# EAGLE design Large Simon Says (EAGLE 6.4)
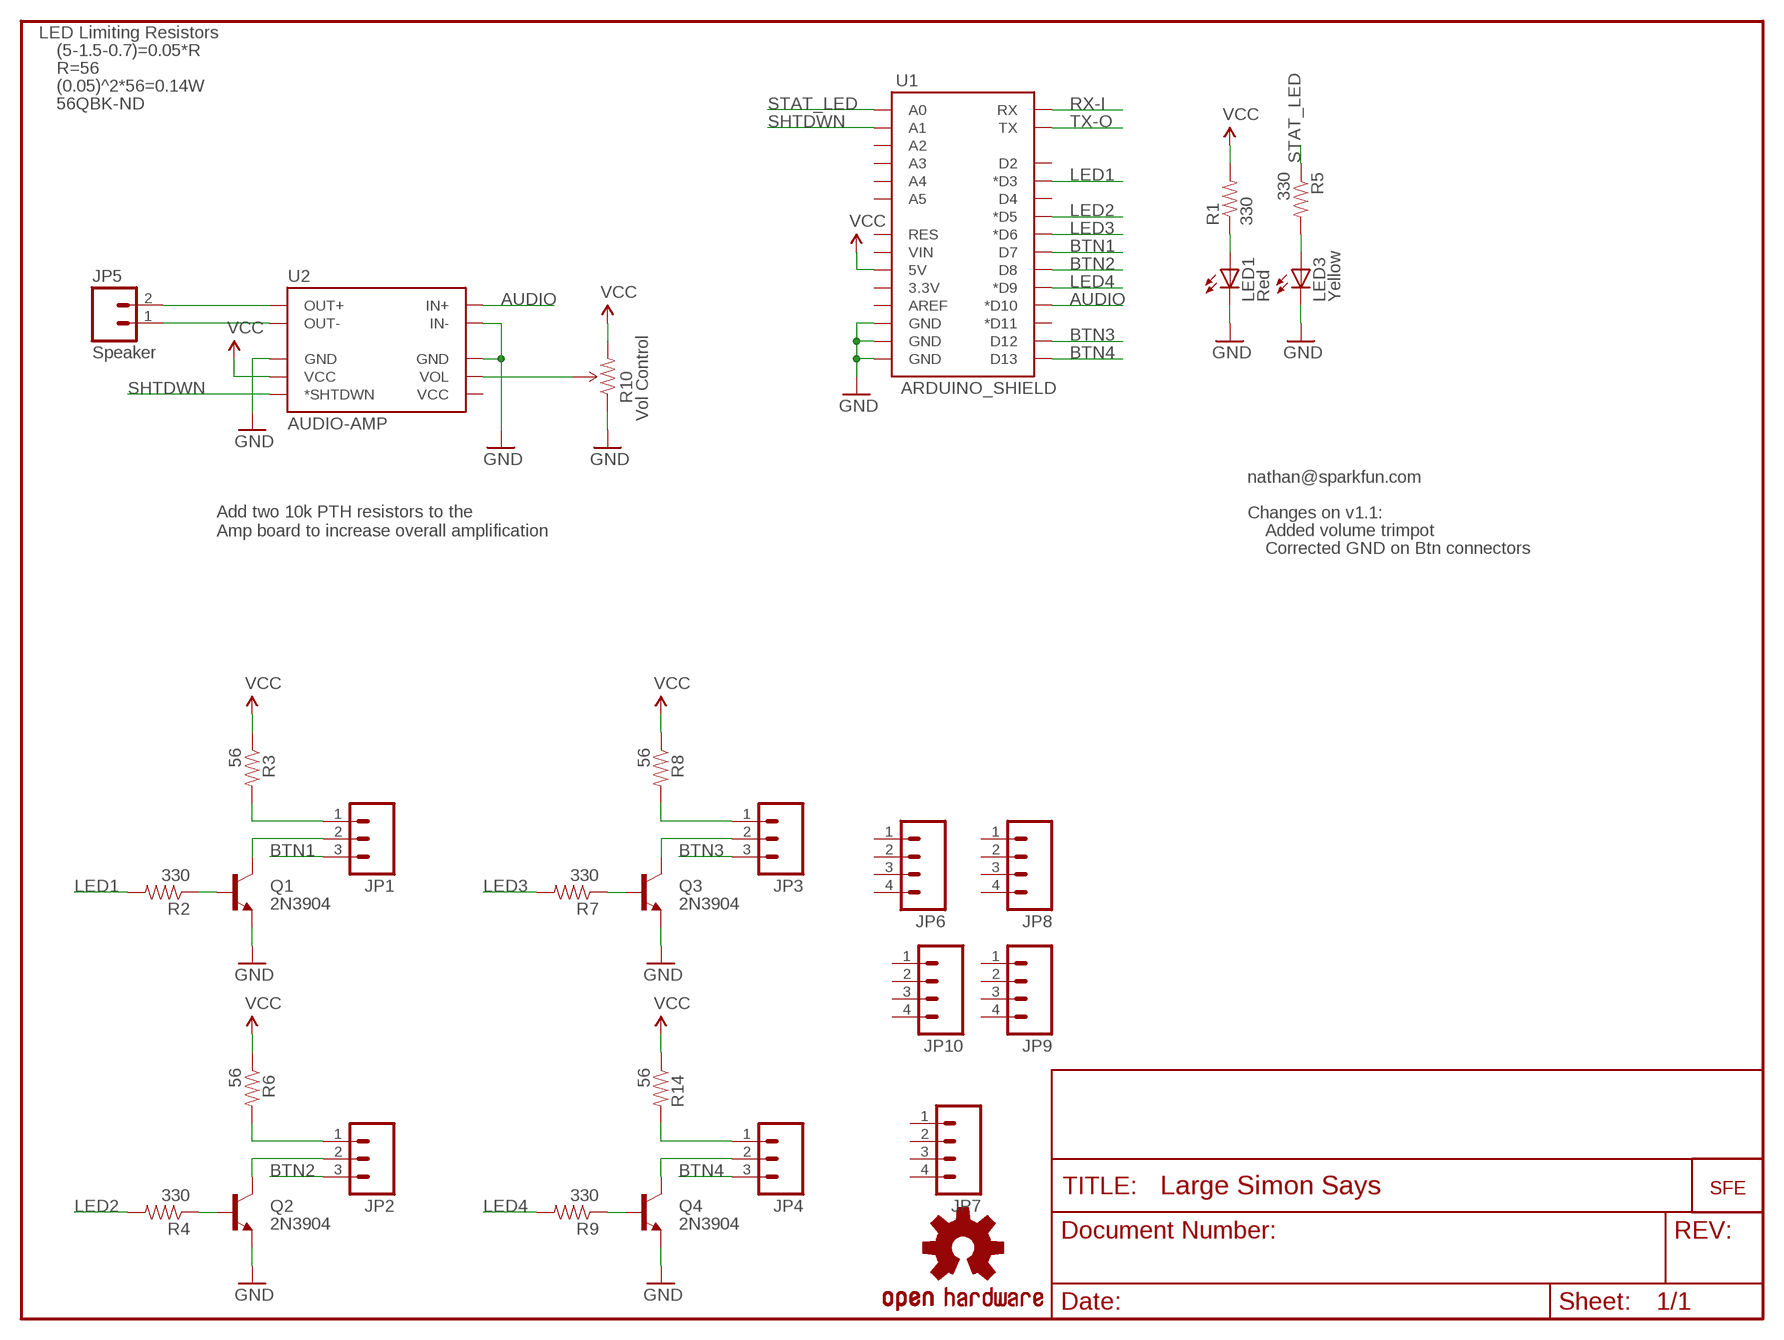
[diagram p0: schematic, sheet 1]

## Parts
JP1  M03JST-PTH-VERT  [JST-3-PTH-VERT]
JP2  M03JST-PTH-VERT  [JST-3-PTH-VERT]
JP3  M03JST-PTH-VERT  [JST-3-PTH-VERT]
JP4  M03JST-PTH-VERT  [JST-3-PTH-VERT]
JP5  Speaker  M02JST-PTH-2  [JST-2-PTH]
JP6  M04JST-PTH  [JST-4-PTH]
JP7  M04JST-PTH  [JST-4-PTH]
JP8  M04JST-PTH  [JST-4-PTH]
JP9  M04JST-PTH  [JST-4-PTH]
JP10  M04JST-PTH  [JST-4-PTH]
LED1  Red  LED5MM  [LED5MM]
LED3  Yellow  LED5MM  [LED5MM]
Q1  2N3904  TRANSISTOR_NPNTO92  [TO-92]
Q2  2N3904  TRANSISTOR_NPNTO92  [TO-92]
Q3  2N3904  TRANSISTOR_NPNTO92  [TO-92]
Q4  2N3904  TRANSISTOR_NPNTO92  [TO-92]
R1  330  RESISTORAXIAL-0.3  [AXIAL-0.3]
R2  330  RESISTORAXIAL-0.3  [AXIAL-0.3]
R3  56  RESISTORAXIAL-0.3  [AXIAL-0.3]
R4  330  RESISTORAXIAL-0.3  [AXIAL-0.3]
R5  330  RESISTORAXIAL-0.3  [AXIAL-0.3]
R6  56  RESISTORAXIAL-0.3  [AXIAL-0.3]
R7  330  RESISTORAXIAL-0.3  [AXIAL-0.3]
R8  56  RESISTORAXIAL-0.3  [AXIAL-0.3]
R9  330  RESISTORAXIAL-0.3  [AXIAL-0.3]
R10  Vol Control  TRIMPOT-PTH-KNOB  [3386U]
R14  56  RESISTORAXIAL-0.3  [AXIAL-0.3]
U1  ARDUINO_SHIELD  ARDUINO_SHIELDNOHOLES  [DUEMILANOVE_SHIELD_NOHOLES]
U2  AUDIO-AMP  AUDIO-AMP-MONODIP  [AUDIO-AMP-MONO]
U$1  LOGO-SFENEW  [SFE-NEW-WEBLOGO]
U$3  OSHW-LOGOS  [OSHW-LOGO-S]

## Nets
AUDIO: U1.D10(*D10) U2.IN+
BTN1: JP1.3 U1.D7
BTN2: JP2.3 U1.D8
BTN3: JP3.3 U1.D12
BTN4: JP4.3 U1.D13
GND: LED1.K(C) LED3.K(C) Q1.1(E) Q2.1(E) Q3.1(E) Q4.1(E) R10.1(CCW) U1.GND@0(GND) U1.GND@1(GND) U1.GND@2(GND) U2.IN- U2.PWR-(GND) U2.VOL-(GND)
LED1: R2.P$2 U1.D3(*D3)
LED2: R4.P$2 U1.D5(*D5)
LED3: R7.P$2 U1.D6(*D6)
LED4: R9.P$2 U1.D9(*D9)
N$1: LED1.A R1.P$1
N$2: Q1.2(B) R2.P$1
N$3: JP1.2 Q1.3(C)
N$4: LED3.A R5.P$2
N$5: JP1.1 R3.P$2
N$6: JP2.2 Q2.3(C)
N$7: JP4.2 Q4.3(C)
N$8: JP5.2 U2.OUT+
N$9: Q2.2(B) R4.P$1
N$10: JP2.1 R6.P$2
N$11: Q3.2(B) R7.P$1
N$12: Q4.2(B) R9.P$1
N$13: JP5.1 U2.OUT-
N$14: R10.2(WIPER) U2.VOL
N$17: JP3.1 R8.P$2
N$18: JP4.1 R14.P$2
N$27: JP3.2 Q3.3(C)
RX-I: U1.RX
SHTDWN: U1.A1 U2.S(*SHTDWN)
STAT_LED: R5.P$1 U1.A0
TX-O: U1.TX
VCC [vcc]: R1.P$2 R3.P$1 R6.P$1 R8.P$1 R10.3(CW) R14.P$1 U1.5V U2.PWR+(VCC)
Unconnected: JP6.1 JP6.2 JP6.3 JP6.4 JP7.1 JP7.2 JP7.3 JP7.4 JP8.1 JP8.2 JP8.3 JP8.4 JP9.1 JP9.2 JP9.3 JP9.4 JP10.1 JP10.2 JP10.3 JP10.4 U1.3.3V U1.A2 U1.A3 U1.A4 U1.A5 U1.AREF U1.D2 U1.D4 U1.D11(*D11) U1.RES U1.VIN U2.VOL+(VCC)

## Notes on the sheet
- LED Limiting Resistors
- (5-1.5-0.7)=0.05*R
- R=56
- (0.05)^2*56=0.14W
- 56QBK-ND
- nathan@sparkfun.com
- Changes on v1.1:
- Add two 10k PTH resistors to the 
  Amp board to increase overall amplification
- Added volume trimpot
- Corrected GND on Btn connectors

## Library data of the parts
JP1-JP4 = SparkFun:M03: Header 3 Standard 3-pin 0.1" header. Use with straight break away headers (SKU : PRT-00116), right angle break away headers (PRT-00553), swiss pins (PRT-00743), machine pins (PRT-00117), and female headers (PRT-00115). Molex polarized connector foot print use with SKU : PRT-08232 with associated crimp pins and housings.
JP5 = SparkFun-Connectors:M02: Header 2 Standard 2-pin 0.1" header. Use with straight break away headers (SKU : PRT-00116), right angle break away headers (PRT-00553), swiss pins (PRT-00743), machine pins (PRT-00117), and female headers (PRT-00115). Molex polarized connector foot print use with SKU : PRT-08233 with associated crimp pins and housings.
JP6-JP10 = SparkFun-Connectors:M04: Header 4 Standard 4-pin 0.1" header. Use with straight break away headers (SKU : PRT-00116), right angle break away headers (PRT-00553), swiss pins (PRT-00743), machine pins (PRT-00117), and female headers (PRT-00115). Molex polarized connector foot print use with SKU : PRT-08231 with associated crimp pins and housings. 1MM SMD Version SKU: PRT-10208
LED1 LED3 = SparkFun:LED: LEDs Standard schematic elements and footprints for 5mm, 3mm, 1206, and 0603 sized LEDs. 5mm - Spark Fun Electronics SKU : COM-00529 (and others)
Q1-Q4 = SparkFun:TRANSISTOR_NPN: Transistor NPN BJT configuration in SOT23 package. MMBT2222 is the common NPN we use. Double check BCE configuration again layout.
R1-R9 R14 = SparkFun:RESISTOR: Resistor Basic schematic elements and footprints for 0603, 1206, and PTH resistors.
R10 = SparkFun-Electromechanical:TRIMPOT: Various small potentiometers for "set-and-forget" applications
U1 = SparkFun:ARDUINO_SHIELD
U2 = SparkFun-Boards:AUDIO-AMP-MONO
U$1 = SparkFun:LOGO-SFE: Spark Fun Electronics PCB Logo This is the standard Spark Fun Electronics PCB logo.
U$3 = SparkFun:OSHW-LOGO: Open Source Hardware Logo This logo indicates the piece of hardware it is found on incorporates a OSHW license and/or adheres to the definition of open source hardware found here: http://freedomdefined.org/OSHW

## Net classes
1 vcc: width 0.508 mm

## Board
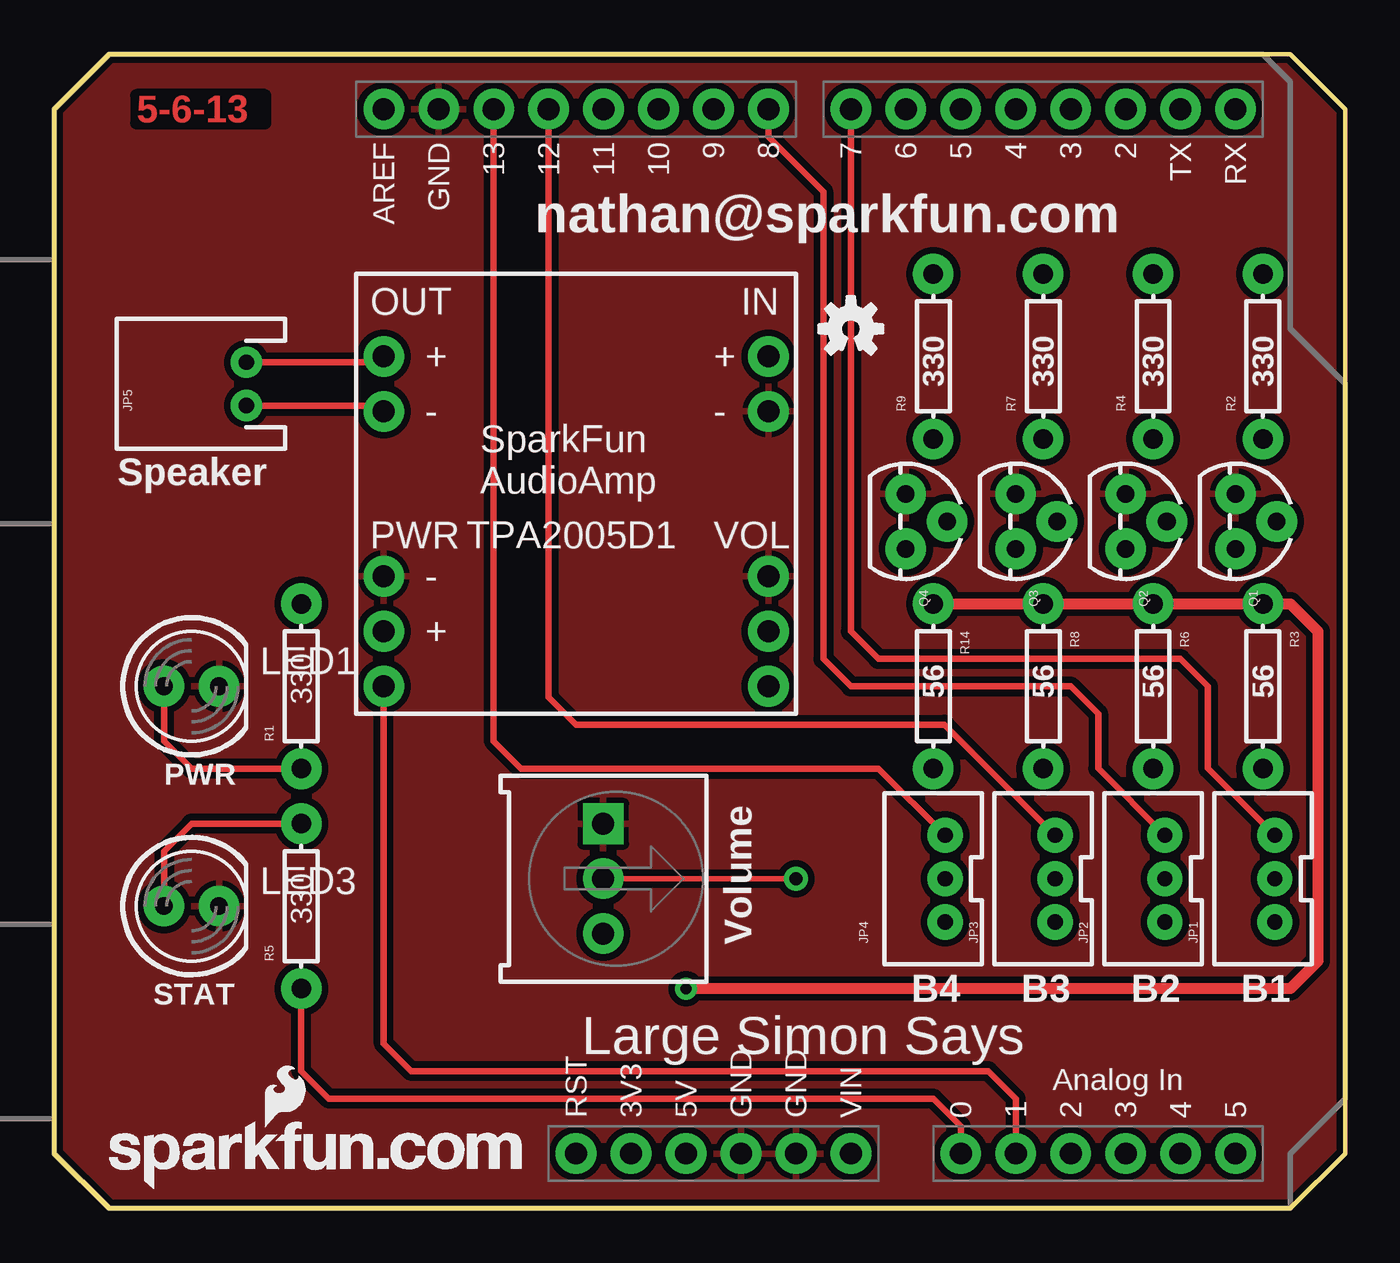
[diagram p1: board, top side]
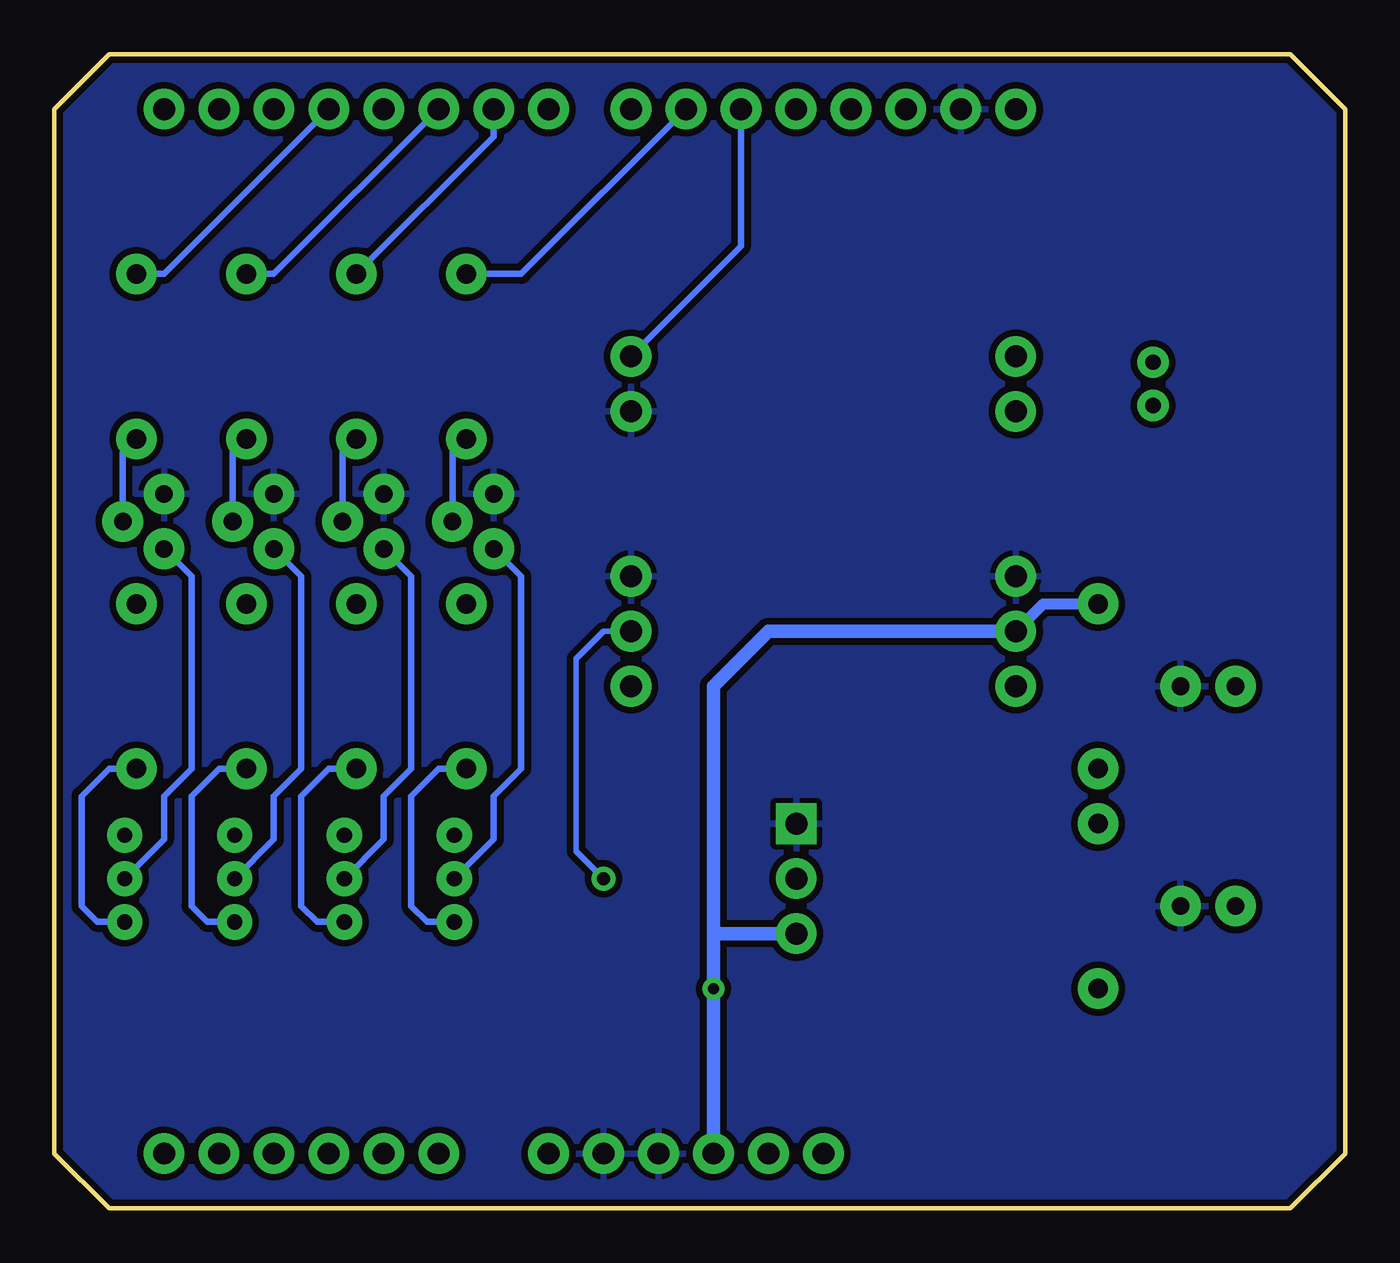
[diagram p2: board, bottom side, seen from below]

Size 59.69 x 53.34 mm. Coordinates in mm from the lower left corner, seen from the top.
Outline: 2.54,0 57.15,0 59.69,2.54 59.69,50.8 57.15,53.34 2.54,53.34 0,50.8 0,2.54 2.54,0
Copper layers (1*16): Top 0.035mm / dielectric 1.5mm / Bottom 0.035mm
Design rules "default": minimum track width 10mil, minimum drill 20mil, track to track 8mil, track to pad 8mil, pad to pad 8mil, via to via 8mil, smd to smd 8mil, copper to edge 10mil, drill to drill 8mil, minimum pad ring 12mil, minimum via ring 10mil, stop-mask expansion 4mil, vias tented up to drill 25mil, thermal gap 10mil

### Footprints (pad centres in the part's own frame; a part is rotated, then mirrored left to right if it is on the bottom)
JST-3-PTH-VERT = drill 0.7 pad 1.626: 1 -2,-0.55; 2 0,-0.55; 3 2,-0.55
JST-2-PTH = drill 0.7 pad 1.448: 1 -1,0; 2 1,0
JST-4-PTH = drill 0.7: 1 -3,-5; 2 -1,-5; 3 1,-5; 4 3,-5
LED5MM = drill 0.813 pad 1.88: A -1.27,0; K 1.27,0
TO-92 = drill 0.813 pad 1.88: 1 -1.27,0; 2 0,1.905; 3 1.27,0
AXIAL-0.3 = drill 0.9 pad 1.88: P$1 -3.81,0; P$2 3.81,0
3386U = drill 1.016 pad 1.88 square: 1 -2.54,-0.015 | drill 1.016 pad 1.88: 2 0,-0.015; 3 2.54,-0.015
DUEMILANOVE_SHIELD_NOHOLES = drill 1.016 pad 1.88: 3.3V 50.8,26.67; 5V 50.8,29.21; A0 50.8,41.91; A1 50.8,44.45; A2 50.8,46.99; A3 50.8,49.53; A4 50.8,52.07; A5 50.8,54.61; AREF 2.54,15.24; D2 2.54,49.53; D3 2.54,46.99; D4 2.54,44.45; D5 2.54,41.91; D6 2.54,39.37; D7 2.54,36.83; D8 2.54,33.02; D9 2.54,30.48; D10 2.54,27.94; D11 2.54,25.4; D12 2.54,22.86; D13 2.54,20.32; GND@0 50.8,31.75; GND@1 50.8,34.29; GND@2 2.54,17.78; RES 50.8,24.13; RX 2.54,54.61; TX 2.54,52.07; VIN 50.8,36.83
AUDIO-AMP-MONO = drill 1.016 pad 1.88: IN+ 8.89,6.35; IN- 8.89,3.81; OUT+ -8.89,6.35; OUT- -8.89,3.81; PWR+ -8.89,-6.35; PWR- -8.89,-3.81; S -8.89,-8.89; VOL 8.89,-6.35; VOL+ 8.89,-8.89; VOL- 8.89,-3.81

### Placement (x,y rotation side)
JP1  55.88,15.24 90 top
JP2  50.8,15.24 90 top
JP3  45.72,15.24 90 top
JP4  40.64,15.24 90 top
JP5  8.89,38.1 90 top
JP6  -8.89,-2.54 0 top  (outside the outline)
JP7  -8.89,-10.16 0 top  (outside the outline)
JP8  -8.89,-17.78 0 top  (outside the outline)
JP9  -8.89,-25.4 0 top  (outside the outline)
JP10  -8.89,-33.02 0 top  (outside the outline)
LED1  6.35,24.13 0 top
LED3  6.35,13.97 0 top
Q1  54.61,31.75 270 top
Q2  49.53,31.75 270 top
Q3  44.45,31.75 270 top
Q4  39.37,31.75 270 top
R1  11.43,24.13 90 top
R2  55.88,39.37 90 top
R3  55.88,24.13 270 top
R4  50.8,39.37 90 top
R5  11.43,13.97 90 top
R6  50.8,24.13 270 top
R7  45.72,39.37 90 top
R8  45.72,24.13 270 top
R9  40.64,39.37 90 top
R10  25.4,15.24 270 top
R14  40.64,24.13 270 top
U1  0,53.34 270 top
U2  24.13,33.02 0 top
U$1  2.54,0.89 0 top
U$3  36.83,40.64 0 top

### Tracks (layer width: path | path; a pad name or v marks a point on that pad's centre or on a via)
AUDIO
  Bottom 0.305: U1.D10 27.94,44.45 U2.IN+
BTN1
  Top 0.305: U1.D7 36.83,26.67 38.1,25.4 52.07,25.4 53.34,24.13 53.34,20.33 JP1.3
BTN2
  Top 0.305: U1.D8 33.02,49.53 35.56,46.99 35.56,25.4 36.83,24.13 46.99,24.13 48.26,22.86 48.26,20.33 JP2.3
BTN3
  Top 0.305: U1.D12 22.86,23.62 24.13,22.35 41.16,22.35 JP3.3
BTN4
  Top 0.305: U1.D13 20.32,21.59 21.59,20.32 38.11,20.32 JP4.3
GND
  pour Top (isolate 0.305): 0,0 0,53.34 59.69,53.34 59.69,0
  pour Bottom (isolate 0.305): 0,0 0,53.34 59.69,53.34 59.69,0
LED1
  Bottom 0.305: U1.D3 54.61,43.18 R2.P$2
LED2
  Bottom 0.305: U1.D5 49.53,43.18 R4.P$2
LED3
  Bottom 0.305: U1.D6 39.37,49.53 R7.P$2
LED4
  Bottom 0.305: U1.D9 38.1,43.18 R9.P$2
N$1
  Top 0.305: R1.P$1 6.35,20.32 5.08,21.59 LED1.A
N$2
  Bottom 0.305: Q1.2 56.52,34.92 R2.P$1
N$3
  Bottom 0.305: Q1.3 53.34,29.21 53.34,20.32 54.61,19.05 54.61,17.06 JP1.2
N$4
  Top 0.305: R5.P$2 6.35,17.78 5.08,16.51 LED3.A
N$5
  Bottom 0.305: R3.P$2 57.15,20.32 58.42,19.05 58.42,13.97 57.69,13.24 JP1.1
N$6
  Bottom 0.305: Q2.3 48.26,29.21 48.26,20.32 49.53,19.05 49.53,17.06 JP2.2
N$7
  Bottom 0.305: Q4.3 38.1,29.21 38.1,20.32 39.37,19.05 39.37,17.06 JP4.2
N$8
  Top 0.305: JP5.2 14.97,39.1 U2.OUT+
N$9
  Bottom 0.305: Q2.2 51.44,34.92 R4.P$1
N$10
  Bottom 0.305: JP2.1 52.61,13.24 53.34,13.97 53.34,19.05 52.07,20.32 R6.P$2
N$11
  Bottom 0.305: Q3.2 46.35,34.92 R7.P$1
N$12
  Bottom 0.305: Q4.2 41.27,34.92 R9.P$1
N$13
  Top 0.305: JP5.1 14.97,37.1 U2.OUT-
N$14  (via drill 0.6)
  Top 0.254: v34.29,15.24 R10.2
  Bottom 0.254: U2.VOL 34.29,26.67 35.56,25.4 35.56,16.51 v34.29,15.24
N$17
  Bottom 0.305: JP3.1 47.53,13.24 48.26,13.97 48.26,19.05 46.99,20.32 R8.P$2
N$18
  Bottom 0.305: JP4.1 42.45,13.24 43.18,13.97 43.18,19.05 41.91,20.32 R14.P$2
N$27
  Bottom 0.305: Q3.3 43.18,29.21 43.18,20.32 44.45,19.05 44.45,17.06 JP3.2
SHTDWN
  Top 0.305: U2.S 15.24,7.62 16.51,6.35 43.18,6.35 44.45,5.08 U1.A1
STAT_LED
  Top 0.305: U1.A0 41.91,3.81 40.64,5.08 12.7,5.08 11.43,6.35 R5.P$1
VCC  (via drill 0.51)
  Top 0.508: v29.21,10.16 57.15,10.16 58.42,11.43 58.42,26.67 57.15,27.94 R3.P$1 R6.P$1 R8.P$1 R14.P$1
  Bottom 0.508: U2.PWR+ 13.97,27.94 R1.P$2
  Bottom 0.635: U1.5V v29.21,10.16 29.21,12.7 | 29.21,12.7 29.21,24.13 26.67,26.67 U2.PWR+ | R10.3 29.21,12.7

### Text on the board
Top: 5-6-13
tPlace: nathan@sparkfun.com | Speaker | PWR | Volume | B4 | B3 | B2 | B1 | STAT | Large Simon Says